# EAGLE design mspfacedraft3 (EAGLE 9.6.2)
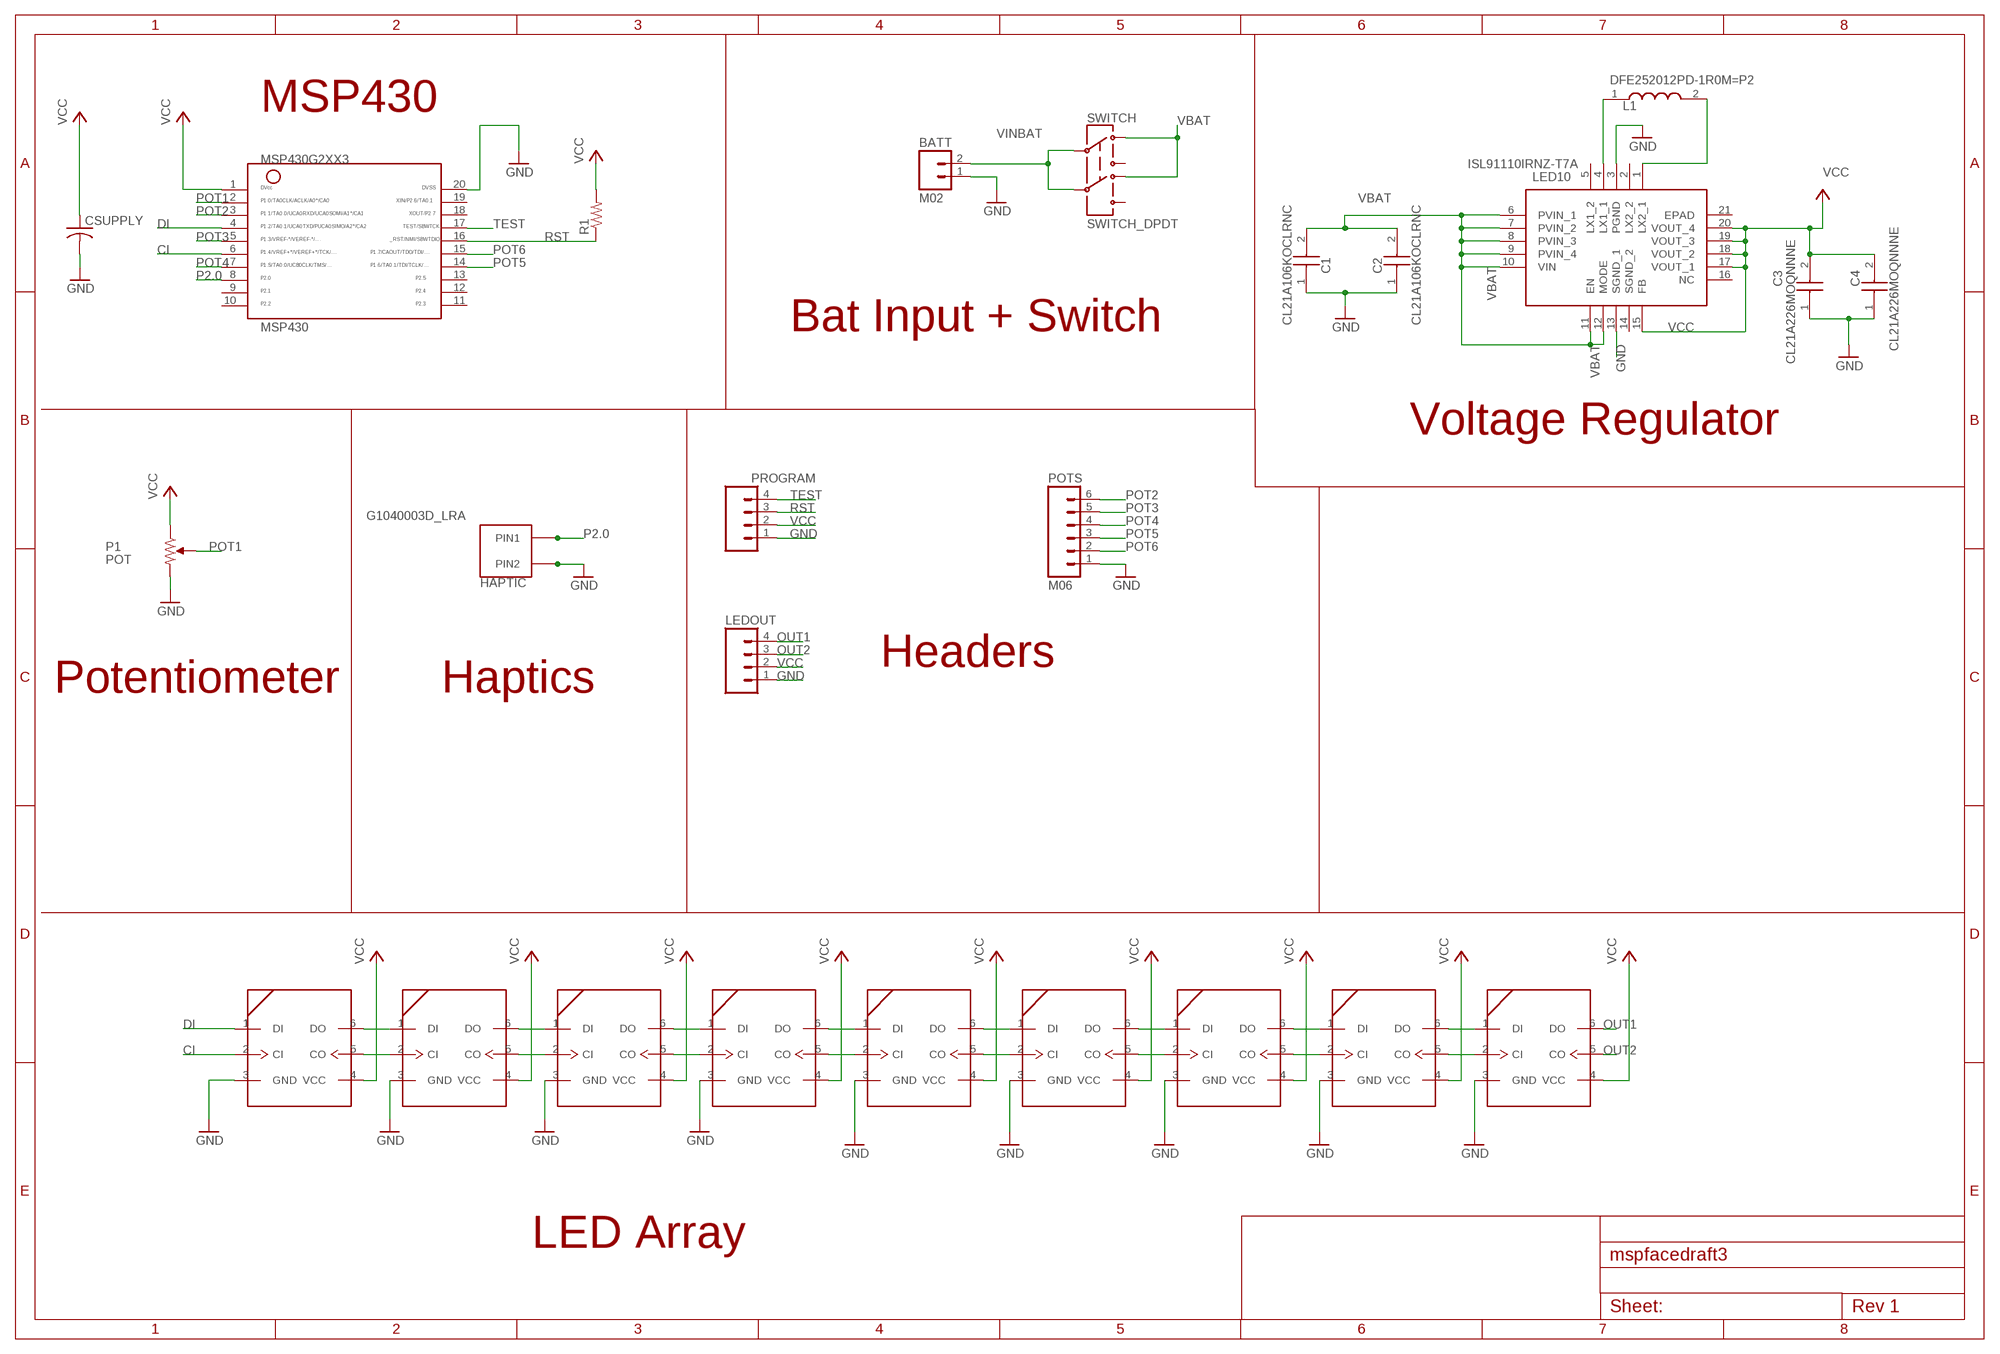
[diagram p0: schematic, sheet 1]

## Parts
BATT  M02  [2PINHEADER]
C1  CL21A106KOCLRNC  [CAPC2012X95N]
C2  CL21A106KOCLRNC  [CAPC2012X95N]
C3  CL21A226MOQNNNE  [CAPC2012X140N]
C4  CL21A226MOQNNNE  [CAPC2012X140N]
CSUPPLY  C-USC1206  [C1206]
HAPTIC  G1040003D_LRA  [COIN_VIBRATION_MOTOR]
L1  DFE252012PD-1R0M=P2  [DFE2HCAH1R0MJ0L]
LED1  APA102  [5050]
LED2  APA102  [5050]
LED3  APA102  [5050]
LED4  APA102  [5050]
LED5  APA102  [5050]
LED6  APA102  [5050]
LED7  APA102  [5050]
LED8  APA102  [5050]
LED9  APA102  [5050]
LED10  ISL91110IRNZ-T7A  [QFN50P400X400X100-21N]
LEDOUT  M04LOCK  [1X04_LOCK]
MSP430  MSP430G2XX3TSSOP  [PW20]
P1  POT  [POT]
POTS  M06  [6PINHEADER]
PROGRAM  M04LOCK  [1X04_LOCK]
R1  R-US_R1206  [R1206]
SWITCH  SWITCH_DPDT  [JS_DPDT_TH]

## Nets
CI: LED1.2(CI) MSP430.6
DI: LED1.1(DI) MSP430.4
GND: BATT.1 C1.1 C2.1 C3.1 C4.1 CSUPPLY.2 HAPTIC.P$2(PIN2) LED1.3(GND) LED2.3(GND) LED3.3(GND) LED4.3(GND) LED5.3(GND) LED6.3(GND) LED7.3(GND) LED8.3(GND) LED9.3(GND) LED10.3(PGND) LED10.13(SGND_1) LEDOUT.1 MSP430.20 P1.GND(CW) POTS.1 PROGRAM.1
N$1: LED1.6(DO) LED2.1(DI)
N$2: LED1.5(CO) LED2.2(CI)
N$3: LED2.6(DO) LED3.1(DI)
N$4: LED2.5(CO) LED3.2(CI)
N$5: LED3.6(DO) LED4.1(DI)
N$6: LED3.5(CO) LED4.2(CI)
N$9: LED4.6(DO) LED5.1(DI)
N$10: LED4.5(CO) LED5.2(CI)
N$11: LED5.6(DO) LED6.1(DI)
N$12: LED5.5(CO) LED6.2(CI)
N$13: LED6.6(DO) LED7.1(DI)
N$14: LED6.5(CO) LED7.2(CI)
N$15: LED7.6(DO) LED8.1(DI)
N$16: LED7.5(CO) LED8.2(CI)
N$17: LED8.6(DO) LED9.1(DI)
N$18: LED8.5(CO) LED9.2(CI)
N$19: L1.1 LED10.4(LX1_1)
N$21: L1.2 LED10.1(LX2_1)
OUT1: LED9.6(DO) LEDOUT.4
OUT2: LED9.5(CO) LEDOUT.3
P2.0: HAPTIC.P$1(PIN1) MSP430.8
POT1: MSP430.2 P1.SIG(S)
POT2: MSP430.3 POTS.6
POT3: MSP430.5 POTS.5
POT4: MSP430.7 POTS.4
POT5: MSP430.14 POTS.3
POT6: MSP430.15 POTS.2
RST: MSP430.16 PROGRAM.3 R1.1
TEST: MSP430.17 PROGRAM.4
VBAT: C1.2 C2.2 LED10.6(PVIN_1) LED10.7(PVIN_2) LED10.8(PVIN_3) LED10.9(PVIN_4) LED10.10(VIN) LED10.11(EN) LED10.12(MODE) SWITCH.1 SWITCH.4
VCC: C3.2 C4.2 CSUPPLY.1 LED1.4(VCC) LED2.4(VCC) LED3.4(VCC) LED4.4(VCC) LED5.4(VCC) LED6.4(VCC) LED7.4(VCC) LED8.4(VCC) LED9.4(VCC) LED10.15(FB) LED10.17(VOUT_1) LED10.18(VOUT_2) LED10.19(VOUT_3) LED10.20(VOUT_4) LEDOUT.2 MSP430.1 P1.VDD(CCW) PROGRAM.2 R1.2
VINBAT: BATT.2 SWITCH.2 SWITCH.5
Unconnected: LED10.2(LX2_2) LED10.5(LX1_2) LED10.14(SGND_2) LED10.16(NC) LED10.21(EPAD) MSP430.9 MSP430.10 MSP430.11 MSP430.12 MSP430.13 MSP430.18 MSP430.19 SWITCH.3 SWITCH.6

## Notes on the sheet
- MSP430
- Bat Input + Switch
- Voltage Regulator
- Headers
- Potentiometer | Haptics
- LED Array

## Library data of the parts
BATT = mspfacedraft3:M02
C1 C2 = SamacSys_Parts:CL21A106KOCLRNC: Cap Ceramic 10uF 16V X5R 10% Pad SMD 0805 85C T/R Source: Datasheet <https://datasheet.lcsc.com/szlcsc/Samsung-Electro-Mechanics-CL21A106KOCLRNC_C318695.pdf>; DESCRIPTION: Cap Ceramic 10uF 16V X5R 10% Pad SMD 0805 85C T/R; HEIGHT: 0.95mm; MANUFACTURER_NAME: Samsung Electro-Mechanics; MANUFACTURER_PART_NUMBER: CL21A106KOCLRNC; MOUSER_PART_NUMBER: 187-CL21A106KOCLRNC; MOUSER_PRICE-STOCK: https://www.mouser.co.uk/ProductDetail/Samsung-Electro-Mechanics/CL21A106KOCLRNC?qs=yOVawPpwOwk0TtWGO3Tj1g%3D%3D
C3 C4 = SamacSys_Parts:CL21A226MOQNNNE: Cap Ceramic 22uF 16V X5R 20% Pad SMD 0805 85C T/R Source: Datasheet <https://datasheet.datasheetarchive.com/originals/distributors/Datasheets-DGA8/2474797.pdf>; DESCRIPTION: Cap Ceramic 22uF 16V X5R 20% Pad SMD 0805 85C T/R; HEIGHT: 1.4mm; MANUFACTURER_NAME: Samsung Electro-Mechanics; MANUFACTURER_PART_NUMBER: CL21A226MOQNNNE; MOUSER_PART_NUMBER: 187-CL21A226MOQNNNE; MOUSER_PRICE-STOCK: https://www.mouser.co.uk/ProductDetail/Samsung-Electro-Mechanics/CL21A226MOQNNNE?qs=xZ%2FP%252Ba9zWqZNj78soW9a4Q%3D%3D
CSUPPLY = rcl:C-US: CAPACITOR, American symbol; SPICEPREFIX: C
HAPTIC = TEMP:G1040003D_LRA: G1040003D Coin Vibration Motor - Jinlong Machinery and Electronics Inc. LRA Coin Vibration Motor SparkFun Products: [PRODUCT 1] <[PRODUCT1LINK]>; PROD_ID: COMP-15536
L1 = SamacSys_Parts:DFE252012PD-1R0M=P2: DFE252012P_D Series Inductor 1.0uH +/-20% 1008 (2520) Source: Datasheet <https://psearch.en.murata.com/inductor/product/DFE252012PD-1R0M#.html>; DESCRIPTION: DFE252012P_D Series Inductor 1.0uH +/-20% 1008 (2520); HEIGHT: 1.2mm; MANUFACTURER_NAME: Murata Electronics; MANUFACTURER_PART_NUMBER: DFE252012PD-1R0M=P2; MOUSER_PART_NUMBER: 81-DFE252012PD1R0MP2; MOUSER_PRICE-STOCK: https://www.mouser.co.uk/ProductDetail/Murata-Electronics/DFE252012PD-1R0M%3dP2?qs=AQlKX63v8RvGsSiwzbLNIA%3D%3D
LED1-LED9 = ELEC327:APA102: APA102 SPI RGB LED APA102 is a chainable RGB LED. The control protocol is a variant of SPI.
LED10 = SamacSys_Parts:ISL91110IRNZ-T7A: Integrated FET Regulators High Current Buck Boost Switching Regulator Delivering 2A of Continuous Output Current Source: Datasheet <https://datasheet.datasheetarchive.com/originals/distributors/Datasheets_SAMA/d3e5c1b0a1d99c18e56c54f82b79d217.pdf>; DESCRIPTION: Integrated FET Regulators High Current Buck Boost Switching Regulator Delivering 2A of Continuous Output Current; HEIGHT: 1mm; MANUFACTURER_NAME: Renesas Electronics; MANUFACTURER_PART_NUMBER: ISL91110IRNZ-T7A; MOUSER_PART_NUMBER: 968-ISL91110IRNZ-T7A; MOUSER_PRICE-STOCK: https://www.mouser.co.uk/ProductDetail/Renesas-Intersil/ISL91110IRNZ-T7A?qs=vyIerDHf%2Fmmihws9YL5pdg%3D%3D
LEDOUT PROGRAM = SparkFun:M04: Header 4 Standard 4-pin 0.1" header. Use with straight break away headers (SKU : PRT-00116), right angle break away headers (PRT-00553), swiss pins (PRT-00743), machine pins (PRT-00117), and female headers (PRT-00115). Molex polarized connector foot print use with SKU : PRT-08231 with associated crimp pins and housings. 1MM SMD Version SKU: PRT-10208
MSP430 = ELEC327:MSP430G2XX3: MSP430G2XX3 PDIP (N) 20 Pin Package
P1 = pot:POT
POTS = mspfacedraft3:M06
R1 = resistor:R-US_: RESISTOR, American symbol
SWITCH = ELEC327:SWITCH_DPDT

## Board
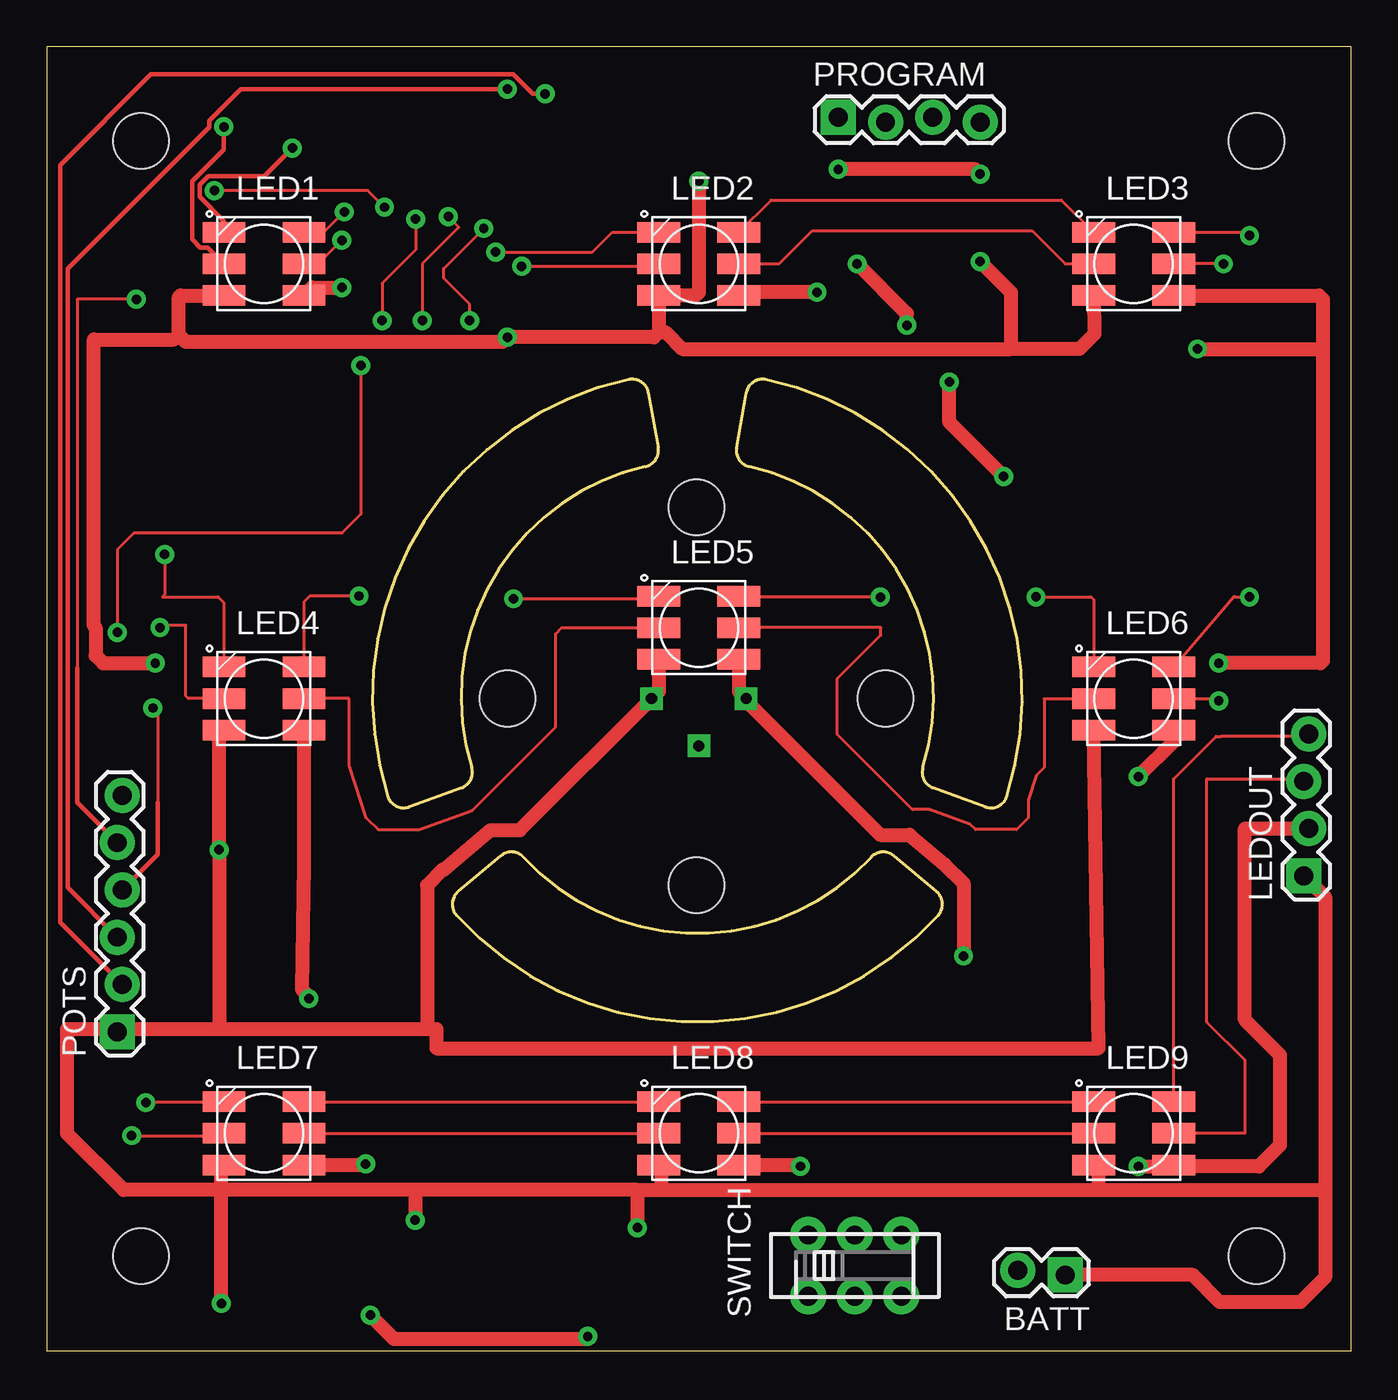
[diagram p1: board, top side]
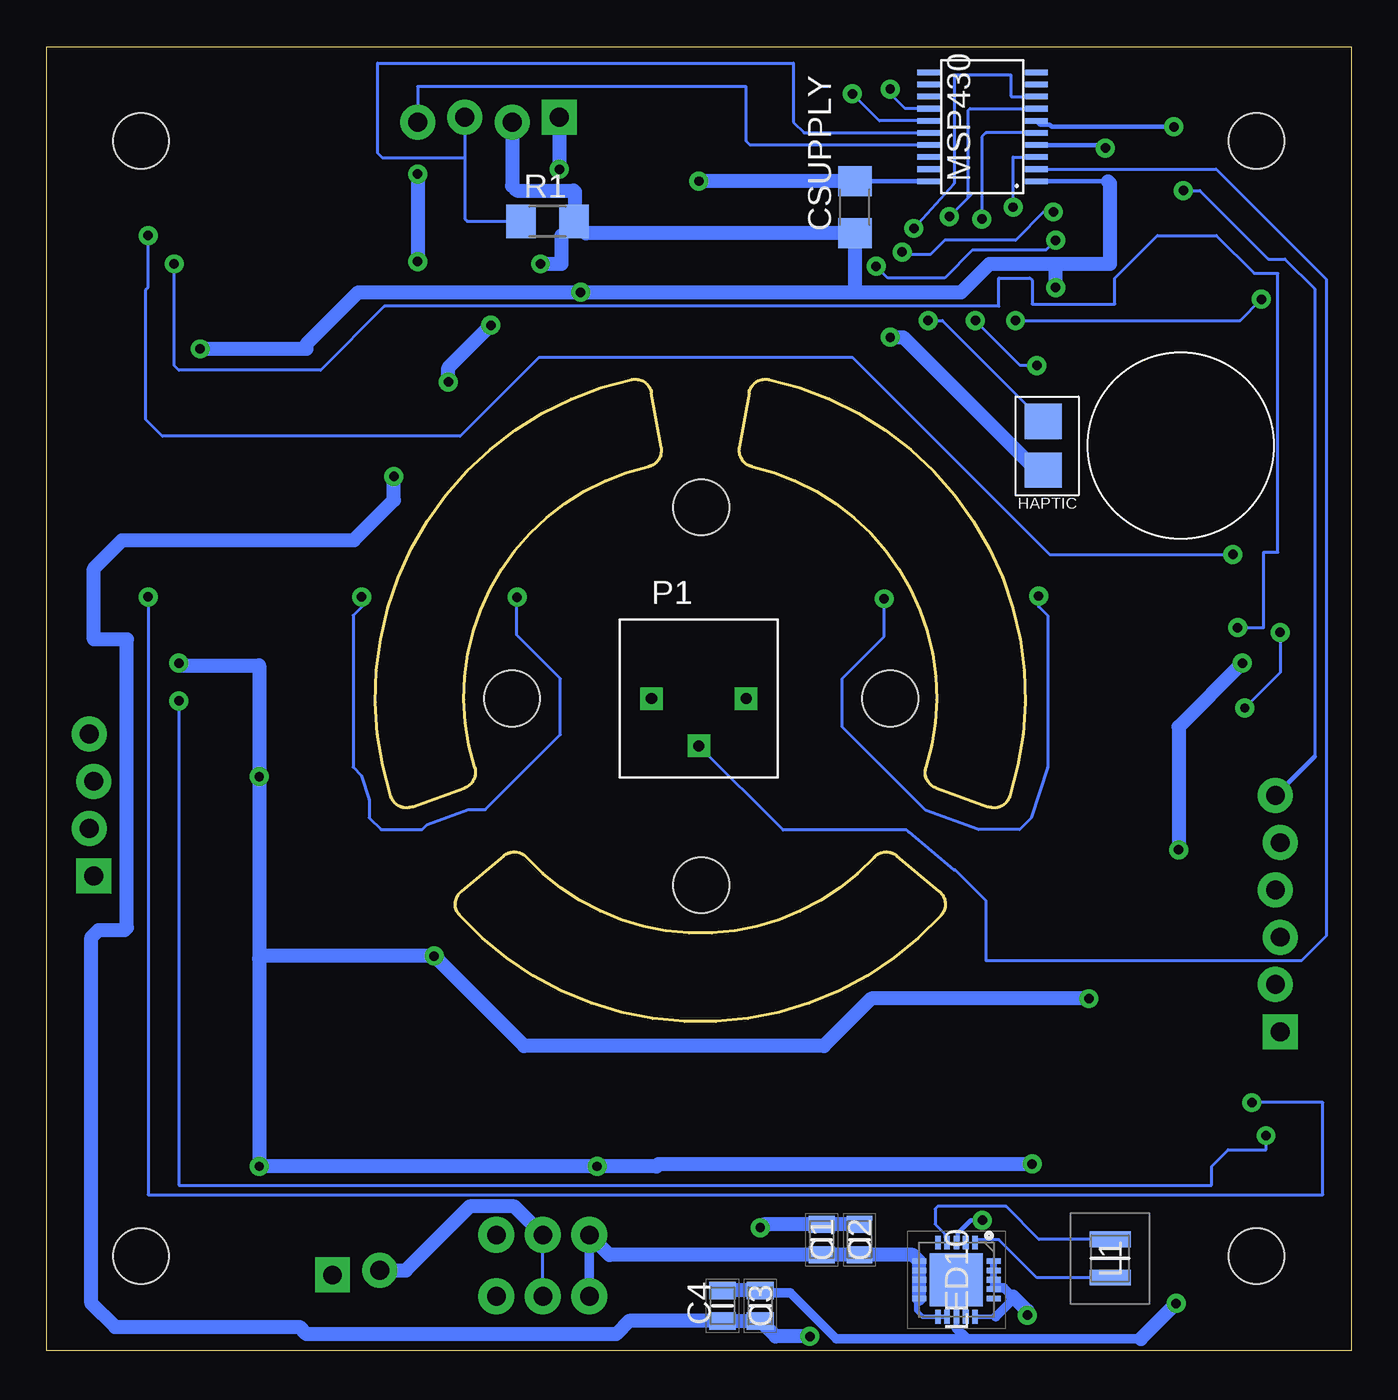
[diagram p2: board, bottom side, seen from below]

Size 70.1 x 70.1 mm. Coordinates in mm from the lower left corner, seen from the top.
Outline: 0,0 70.1,0 70.1,70.1 0,70.1 0,0
Outline: 50.45,29.23 arc92 51.6,29.79 arc96 38.66,52.2 arc92 37.6,51.48 37.08,48.54 arc87 37.76,47.52 arc-95 47.1,31.35 arc87 47.64,30.25 50.45,29.23
Outline: 32.35,51.48 arc92 31.28,52.2 arc96 18.35,29.79 arc92 19.5,29.23 22.3,30.25 arc87 22.85,31.35 arc-95 32.19,47.52 arc87 32.87,48.54 32.35,51.48
Outline: 22.12,24.68 arc92 22.04,23.4 arc96 47.91,23.4 arc92 47.82,24.68 45.53,26.6 arc87 44.31,26.52 arc-95 25.64,26.52 arc87 24.41,26.6 22.12,24.68
Copper layers (1*16): Top 0.035mm / dielectric 1.5mm / Bottom 0.035mm
Design rules "AdvancedCircuitsBarebones": minimum track width 6mil, minimum drill 20mil, track to track 6mil, track to pad 6mil, pad to pad 6mil, via to via 6mil, smd to smd 6mil, copper to edge 10mil, drill to drill 6mil, minimum pad ring 12mil, minimum via ring 10mil, stop-mask expansion 4mil, vias tented up to drill 25mil, thermal gap 10mil
Holes 3 mm at 34.92,25.02 24.77,35.05 34.92,45.34 45.09,35.05 65.02,65.02 5.08,65.02 5.08,5.08 65.02,5.08

### Footprints (pad centres in the part's own frame; a part is rotated, then mirrored left to right if it is on the bottom)
2PINHEADER = drill 1.016 pad 1.88 square: 1 -1.27,0.127 | drill 1.016 pad 1.88: 2 1.27,-0.127
CAPC2012X95N = smd 0.91 x 1.39: 1 -0.82,0; 2 0.82,0
CAPC2012X140N = smd 0.94 x 1.43: 1 -0.82,0; 2 0.82,0
C1206 = smd 1.6 x 1.8: 1 -1.4,0; 2 1.4,0
COIN_VIBRATION_MOTOR = smd 2 x 1.9: P$1 7.4,-1.31; P$2 7.4,1.31
DFE2HCAH1R0MJ0L = smd 0.85 x 2.2: 1 -1.025,0; 2 1.025,0
5050 = smd 2.3 x 1.1: 1 -2.15,1.7; 2 -2.15,0; 3 -2.15,-1.7; 4 2.15,-1.7; 5 2.15,0; 6 2.15,1.7
QFN50P400X400X100-21N = smd 0.75 x 0.3: 1 -2,1; 2 -2,0.5; 3 -2,0; 4 -2,-0.5; 5 -2,-1; 11 2,-1; 12 2,-0.5; 13 2,0; 14 2,0.5; 15 2,1 | smd 0.3 x 0.75: 6 -1,-2; 7 -0.5,-2; 8 0,-2; 9 0.5,-2; 10 1,-2; 16 1,2; 17 0.5,2; 18 0,2; 19 -0.5,2; 20 -1,2 | smd 2.85 x 2.85: 21 0,0
1X04_LOCK = drill 1.016 pad 1.88 square: 1 0,0.127 | drill 1.016 pad 1.88: 2 2.54,-0.127; 3 5.08,0.127; 4 7.62,-0.127
PW20 = smd 0.3 x 1.2: 1 -2.925,-2.9; 2 -2.275,-2.9; 3 -1.625,-2.9; 4 -0.975,-2.9; 5 -0.325,-2.9; 6 0.325,-2.9; 7 0.975,-2.9; 8 1.625,-2.9; 9 2.275,-2.9; 10 2.925,-2.9; 11 2.925,2.9; 12 2.275,2.9; 13 1.625,2.9; 14 0.975,2.9; 15 0.325,2.9; 16 -0.325,2.9; 17 -0.975,2.9; 18 -1.625,2.9; 19 -2.275,2.9; 20 -2.925,2.9
POT = drill 0.6 square: GND 2.54,0; SIG 0,-2.54; VDD -2.54,0
6PINHEADER = drill 1.016 pad 1.88 square: 1 -3.81,0.127 | drill 1.016 pad 1.88: 2 -1.27,-0.127; 3 1.27,0.127; 4 3.81,-0.127; 5 6.35,0.127; 6 8.89,-0.127
R1206 = smd 1.6 x 1.803: 1 -1.422,0; 2 1.422,0
JS_DPDT_TH = drill 1 pad 1.93: 1 -2.5,-1.65; 2 0,-1.65; 3 2.5,-1.65; 4 -2.5,1.65; 5 0,1.65; 6 2.5,1.65

### Placement (x,y rotation side)
BATT  53.47,4.19 180 top
C1  28.45,5.97 270 bottom
C2  26.42,5.97 270 bottom
C3  31.75,2.41 270 bottom
C4  33.78,2.41 270 bottom
CSUPPLY  26.67,61.47 90 bottom
HAPTIC  9.14,48.64 180 bottom
L1  12.95,4.95 270 bottom
LED1  11.68,58.42 0 top
LED2  35.05,58.42 0 top
LED3  58.42,58.42 0 top
LED4  11.68,35.05 0 top
LED5  35.05,38.86 0 top
LED6  58.42,35.05 0 top
LED7  11.68,11.68 0 top
LED8  35.05,11.68 0 top
LED9  58.42,11.68 0 top
LED10  21.21,3.81 270 bottom
LEDOUT  67.69,25.53 90 top
MSP430  19.81,65.79 90 bottom
P1  35.05,35.05 0 bottom
POTS  3.94,20.95 90 top
PROGRAM  42.55,66.17 0 top
R1  43.18,60.71 0 bottom
SWITCH  43.43,4.57 0 top

### Tracks (layer width: path | path; a pad name or v marks a point on that pad's centre or on a via)
CI  (via drill 0.51)
  Top 0.254: v9.53,65.79 9.53,64.55 7.82,62.85 7.82,59.74 8.27,59.29 8.66,59.29 LED1.2
  Bottom 0.254: MSP430.6 16.69,65.89 16.2,65.89 16.09,65.79 v9.53,65.79
DI  (via drill 0.51)
  Top 0.254: v13.21,64.64 11.71,63.14 8.69,63.14 8.23,62.68 8.23,62.03 9.53,60.73 LED1.1
  Bottom 0.254: v13.21,64.64 13.38,64.81 MSP430.4
GND  (via drill 0.51)
  Top 0.762: 51.82,53.85 34.16,53.85 33.27,54.75 32.9,54.75 | 9.4,8.64 9.4,8.76 | 9.4,8.76 9.4,9.85 LED7.3 | 68.71,8.64 68.71,24.38 LEDOUT.1 | LED6.3 56.54,16.26 20.95,16.26 20.95,17.27 20.45,17.27 | 20.45,17.27 20.45,25.02 21.28,25.85 21.35,25.85 23.88,27.98 25.44,27.98 P1.GND 32.9,35.44 LED5.3 | 20.45,17.27 9.27,17.27 | 9.27,17.27 3.94,17.27 | 3.94,17.27 1.09,17.27 1.09,11.68 4.14,8.64 9.4,8.64 | v50.16,63.25 49.91,63.5 v42.55,63.5 | v50.16,58.55 51.82,56.9 51.82,53.85 | LED3.3 56.31,54.66 55.5,53.85 51.82,53.85 | 9.27,17.27 v9.27,26.92 9.27,33.09 LED4.3 | 31.75,8.64 33.02,8.64 | 33.02,8.64 56.52,8.64 | 31.75,8.64 19.81,8.64 | 19.81,8.64 9.53,8.64 | 9.53,8.64 9.4,8.64 | 9.53,8.64 9.4,8.76 | 56.52,8.64 68.71,8.64 | 31.75,8.64 v31.75,6.6 | v9.4,2.54 9.4,8.64 | 68.71,8.64 68.71,3.94 67.37,2.6 63.06,2.6 61.59,4.06 BATT.1 | 7.24,54.48 6.96,54.48 6.84,54.36 2.54,54.36 2.54,38.96 2.64,38.86 2.64,37.37 3.05,36.96 v5.84,36.96 | LED8.3 33.02,9.87 33.02,8.64 | LED9.3 56.52,9.74 56.52,8.64 | v35.05,62.87 35.05,56.9 34.88,56.72 LED2.3 32.9,54.75 | 32.9,54.75 32.63,54.48 v24.77,54.48 24.51,54.22 7.49,54.22 7.24,54.48 | 7.24,54.48 7.11,54.6 7.11,56.64 7.19,56.72 LED1.3 | 19.81,8.64 v19.81,7.01 | POTS.1 3.94,17.27
  Bottom 0.254: MSP430.20 CSUPPLY.2 | LED10.3 21.14,5.88 21.14,6.3 20.43,7.01 v19.81,7.01 | 21.21,1.21 LED10.13
  Bottom 0.508: 11.3,0.64 20.63,0.64 | 20.63,0.64 21.21,1.21 | C3.1 31.62,3.1 30.13,3.1 27.66,0.64 20.63,0.64
  Bottom 0.762: CSUPPLY.2 28.57,62.87 v35.05,62.87 | PROGRAM.1 v42.55,63.5 | v50.16,63.25 v50.16,58.55 | v9.4,2.54 11.3,0.64 | v24.77,54.48 24.07,54.48 16.93,47.33 HAPTIC.P$2 | v5.84,36.96 9.27,33.53 v9.27,26.92 | C3.1 C4.1 | v31.75,6.6 31.57,6.79 C1.1 C2.1
N$1  (via drill 0.51)
  Top 0.152: LED1.6 14.91,60.12 v16,61.21 | v24.13,59.05 29.34,59.05 30.4,60.12 LED2.1
  Bottom 0.152: v16,61.21 16.51,61.21 18.03,59.69 21.84,59.69 22.61,58.93 24,58.93 v24.13,59.05
N$2  (via drill 0.51)
  Top 0.152: LED1.5 14.61,58.42 v15.88,59.69 | v25.53,58.29 32.77,58.29 LED2.2
  Bottom 0.152: v15.88,59.69 16.38,59.18 20.32,59.18 21.84,57.66 24.89,57.66 v25.53,58.29
N$3
  Top 0.152: LED2.6 38.93,61.85 54.54,61.85 LED3.1
N$4
  Top 0.152: LED2.5 39.37,58.42 41.15,60.2 52.96,60.2 54.74,58.42 LED3.2
N$5  (via drill 0.51)
  Top 0.152: v6.35,42.8 6.35,40.64 6.22,40.51 9.23,40.51 9.53,40.21 LED4.1 | LED3.6 64.47,60.12 v64.64,59.94
  Bottom 0.152: v6.35,42.8 16.2,42.8 26.79,53.39 43.64,53.39 47.88,49.15 63.88,49.15 64.77,50.04 64.77,57.02 64.64,57.15 64.64,59.82 64.71,59.88 v64.64,59.94
N$6  (via drill 0.51)
  Top 0.152: LED4.2 7.62,35.05 7.49,35.18 7.49,38.99 6.22,38.99 v6.1,38.86 | v63.25,58.42 LED3.5
  Bottom 0.152: v6.1,38.86 4.7,38.86 4.7,42.93 3.94,42.93 3.94,57.91 5.21,57.91 7.24,59.94 10.41,59.94 12.7,57.66 12.7,56.26 17.14,56.26 17.14,57.53 17.27,57.66 18.92,57.66 18.92,56.13 51.94,56.13 55.37,52.7 62.99,52.7 63.25,52.96 v63.25,58.42
N$9  (via drill 0.51)
  Top 0.152: v25.09,40.42 32.76,40.42 LED5.1 | v16.79,40.56 14.15,40.56 13.83,40.25 LED4.6
  Bottom 0.152: v16.79,40.56 16.79,40 16.31,39.52 16.31,31.36 17.18,28.66 17.18,28.65 17.82,28.01 20.03,28.01 22.87,29.04 27.36,33.53 27.36,36.13 25.09,38.39 v25.09,40.42
N$10
  Top 0.152: LED5.2 27.69,38.86 27.36,38.53 27.36,33.53 22.87,29.04 20.03,28.01 17.82,28.01 17.18,28.65 16.3,31.37 16.26,31.42 16.26,35.05 LED4.5
N$11  (via drill 0.51)
  Top 0.152: v44.81,40.5 37.26,40.5 LED5.6 | v53.17,40.51 56.13,40.51 56.27,40.38 LED6.1
  Bottom 0.152: v53.17,40.51 53.17,39.98 53.63,39.52 53.63,31.36 53.19,30.92 52.77,29.61 52.77,28.65 52.13,28.01 49.92,28.01 49.65,28.27 47.44,29.08 46.53,29.08 42.49,33.12 42.49,36.13 44.83,38.46 44.83,40.51 44.82,40.51 v44.81,40.5
N$12
  Top 0.152: LED5.5 44.83,38.86 44.83,38.46 42.49,36.13 42.49,33.12 46.53,29.08 47.44,29.08 49.65,28.27 49.92,28.01 52.13,28.01 52.77,28.65 52.77,29.61 53.19,30.92 53.63,31.36 53.63,35.01 53.59,35.05 LED6.2
N$13  (via drill 0.51)
  Top 0.152: LED6.6 63.83,40.56 63.88,40.51 v64.64,40.51 | v5.33,13.34 5.38,13.38 LED7.1
  Bottom 0.152: v64.64,40.51 64.64,8.38 1.52,8.38 1.52,13.34 v5.33,13.34
N$14  (via drill 0.51)
  Top 0.152: v62.99,34.92 62.81,35.05 LED6.5 | v4.57,11.56 9.41,11.56 LED7.2
  Bottom 0.152: v62.99,34.92 62.99,8.89 7.49,8.89 7.49,9.91 6.6,10.79 4.57,10.79 v4.57,11.56
N$15
  Top 0.152: LED7.6 LED8.1
N$16
  Top 0.152: LED7.5 LED8.2
N$17
  Top 0.152: LED8.6 LED9.1
N$18
  Top 0.152: LED8.5 LED9.2
N$19
  Bottom 0.152: LED10.4 21.71,5.97 21.83,6.09 21.83,6.28 22.35,6.8 22.35,7.62 22.23,7.75 18.54,7.75 16.77,5.98 L1.1
N$21
  Bottom 0.152: L1.2 16.88,3.93 18.92,5.97 20.05,5.97 LED10.1
OUT1
  Top 0.152: LEDOUT.4 67.69,33.02 63.12,33.02 62.86,33.02 60.57,30.73 LED9.6
OUT2
  Top 0.152: LEDOUT.3 67.94,30.61 68.07,30.73 62.36,30.73 62.36,17.65 64.39,15.62 64.39,11.68 LED9.5
P2.0  (via drill 0.51)
  Top 0.152: v22.73,55.37 22.73,56.26 21.34,57.66 21.34,58.17 v23.5,60.33
  Bottom 0.152: HAPTIC.P$1 21.96,55.37 v22.73,55.37 | v23.5,60.33 21.34,62.74 21.34,68.58 18.29,68.58 18.29,67.44 18.26,67.41 MSP430.8
POT1
  Bottom 0.152: MSP430.2 7.25,63.51 1.34,57.6 1.34,22.29 2.67,20.95 19.62,20.95 19.62,24.19 21.28,25.85 21.36,25.85 23.78,27.88 23.88,27.98 30.52,27.98 P1.SIG
POT2  (via drill 0.51)
  Top 0.152: v18.16,61.47 17.27,62.36 v9.02,62.36
  Bottom 0.152: v18.16,61.47 18.16,64.16 MSP430.3 | 1.96,31.93 1.96,57.08 3.56,58.67 4.45,58.67 8.13,62.36 v9.02,62.36
  Bottom 0.254: 1.96,31.93 POTS.6
POT3  (via drill 0.51)
  Top 0.152: v19.84,60.83 19.84,59.18 18.03,57.38 v18.03,55.37 | v4.83,56.52 1.65,56.52 1.65,36.7
  Top 0.254: 1.65,36.7 1.65,29.46 POTS.5
  Bottom 0.152: MSP430.5 19.63,65.46 19.84,65.25 v19.84,60.83 | v18.03,55.37 5.97,55.37 v4.83,56.52
POT4  (via drill 0.51)
  Top 0.152: v21.59,60.96 22.16,60.39 20.19,58.42 v20.19,55.37 | v16.89,52.96 16.89,44.96 15.88,43.94 4.7,43.94 3.81,43.05 v3.81,38.61 | v5.71,34.54 5.97,34.29 5.97,29.46 5.97,29.34
  Top 0.254: 5.97,29.46 5.97,26.67 POTS.4
  Bottom 0.152: v16.89,52.96 17.78,52.96 v20.19,55.37 | v3.81,38.61 3.81,36.45 v5.71,34.54 | v21.59,60.96 20.45,62.1 20.45,62.23 20.57,61.99 20.57,66.67 20.49,66.76 MSP430.7
POT5  (via drill 0.51)
  Top 0.254: v24.77,67.82 10.44,67.82 8.74,66.11 8.74,65.76 1.14,58.17 1.14,24.89 POTS.3
  Bottom 0.152: MSP430.14 23.96,66.76 24.77,67.56 v24.77,67.82
POT6  (via drill 0.51)
  Top 0.254: v26.8,67.56 26.13,67.56 25.09,68.61 5.61,68.61 0.74,63.73 0.74,23.01 POTS.2
  Bottom 0.152: MSP430.15 25.34,66.11 v26.8,67.56
RST
  Bottom 0.152: MSP430.16 29.39,65.46 29.97,66.04 29.97,69.22 52.32,69.22 52.32,64.39 52.07,64.14 47.62,64.14 | R1.1 47.5,60.71 47.62,60.83 47.62,64.14 | PROGRAM.3 47.62,64.14
TEST
  Bottom 0.152: MSP430.17 32.3,64.81 32.51,65.02 32.51,67.94 50.16,67.94 PROGRAM.4
VBAT
  Bottom 0.254: LED10.12 LED10.11 23.02,1.81 23.37,2.16 23.37,2.65 LED10.10
  Bottom 0.508: SWITCH.4 SWITCH.1
  Bottom 0.762: SWITCH.4 39.86,5.15 C1.2 C2.2 23.55,5.15 LED10.6 LED10.7 LED10.8 LED10.9 LED10.10
VCC  (via drill 0.51)
  Top 0.762: 68.58,53.85 68.58,56.52 68.38,56.72 LED3.4 | 68.58,53.85 68.58,37.08 68.45,36.96 v62.99,36.96 | LEDOUT.2 64.39,28.07 64.39,17.78 66.29,15.88 66.29,11.05 65.15,9.91 60.65,9.91 | LED5.4 37.2,35.44 P1.VDD 37.59,34.92 44.79,27.72 46.37,27.72 48.24,26.15 49.28,25.11 v49.28,21.21 | LED4.4 13.83,26.14 13.72,19.43 14.1,19.05 v14.1,18.92 | v41.4,56.9 36.95,56.9 LED2.4 | v51.44,46.99 48.51,49.91 v48.51,52.07 | v46.23,55.12 46.23,55.75 v43.56,58.42 | LED8.4 40.44,9.98 v40.51,9.91 | LED7.4 17.1,9.98 v17.14,10.03 | v58.67,30.86 60.57,32.76 LED6.4 | v61.85,53.85 68.58,53.85 | LED1.4 14.26,57.15 v15.88,57.15 | 60.65,9.91 LED9.4 | v58.67,9.91 60.65,9.91 | v17.4,1.91 18.67,0.64 28.96,0.64 v29.08,0.76
  Bottom 0.254: 13.08,62.86 MSP430.1 | 20.19,1.79 LED10.15 19.11,1.81
  Bottom 0.381: LED10.17 19.21,3.37 LED10.18 LED10.19 LED10.20
  Bottom 0.508: 19.21,3.37 18.67,3.37 18.22,2.92 18.17,2.92 18.17,2.75 19.11,1.81
  Bottom 0.762: 26.67,56.9 v41.4,56.9 53.34,56.9 56.13,54.1 56.13,53.85 v61.85,53.85 | v17.14,10.03 37.21,10.03 37.34,9.91 v40.51,9.91 v58.67,9.91 58.67,21.08 | 58.67,21.08 v58.67,30.86 58.67,36.83 62.87,36.83 v62.99,36.96 | 58.67,21.08 58.55,21.21 v49.28,21.21 44.44,16.37 28.33,16.37 25.78,18.92 v14.1,18.92 | 41.71,60.66 41.12,60.07 CSUPPLY.1 26.67,56.9 | PROGRAM.2 45.09,62.61 44.83,62.36 41.78,62.36 41.71,62.28 41.71,60.66 | 26.67,56.9 20.95,56.9 19.43,58.42 15.88,58.42 | v51.44,46.99 51.44,45.72 53.59,43.56 66.04,43.56 67.56,42.04 67.56,38.23 65.79,38.23 65.79,22.73 65.91,22.61 67.31,22.61 67.69,22.23 67.69,2.54 66.42,1.27 56.52,1.27 56.13,0.89 39.5,0.89 38.79,1.59 C4.2 C3.2 30.92,0.76 v29.08,0.76 | v48.51,52.07 48.51,52.83 v46.23,55.12 | v43.56,58.42 42.42,58.42 42.42,59.94 41.78,60.58 | 41.78,60.58 41.71,60.66 | v15.88,57.15 15.88,58.42 | 15.88,58.42 12.95,58.42 12.95,62.74 13.08,62.86 | R1.2 41.78,60.68 41.78,60.58 | v17.4,1.91 17.4,2.15 18.17,2.92
VINBAT
  Bottom 0.152: SWITCH.2 SWITCH.5
  Bottom 0.762: SWITCH.5 44.96,7.75 47.37,7.75 50.8,4.32 BATT.2